# EAGLE design down_converter (EAGLE 6.2)
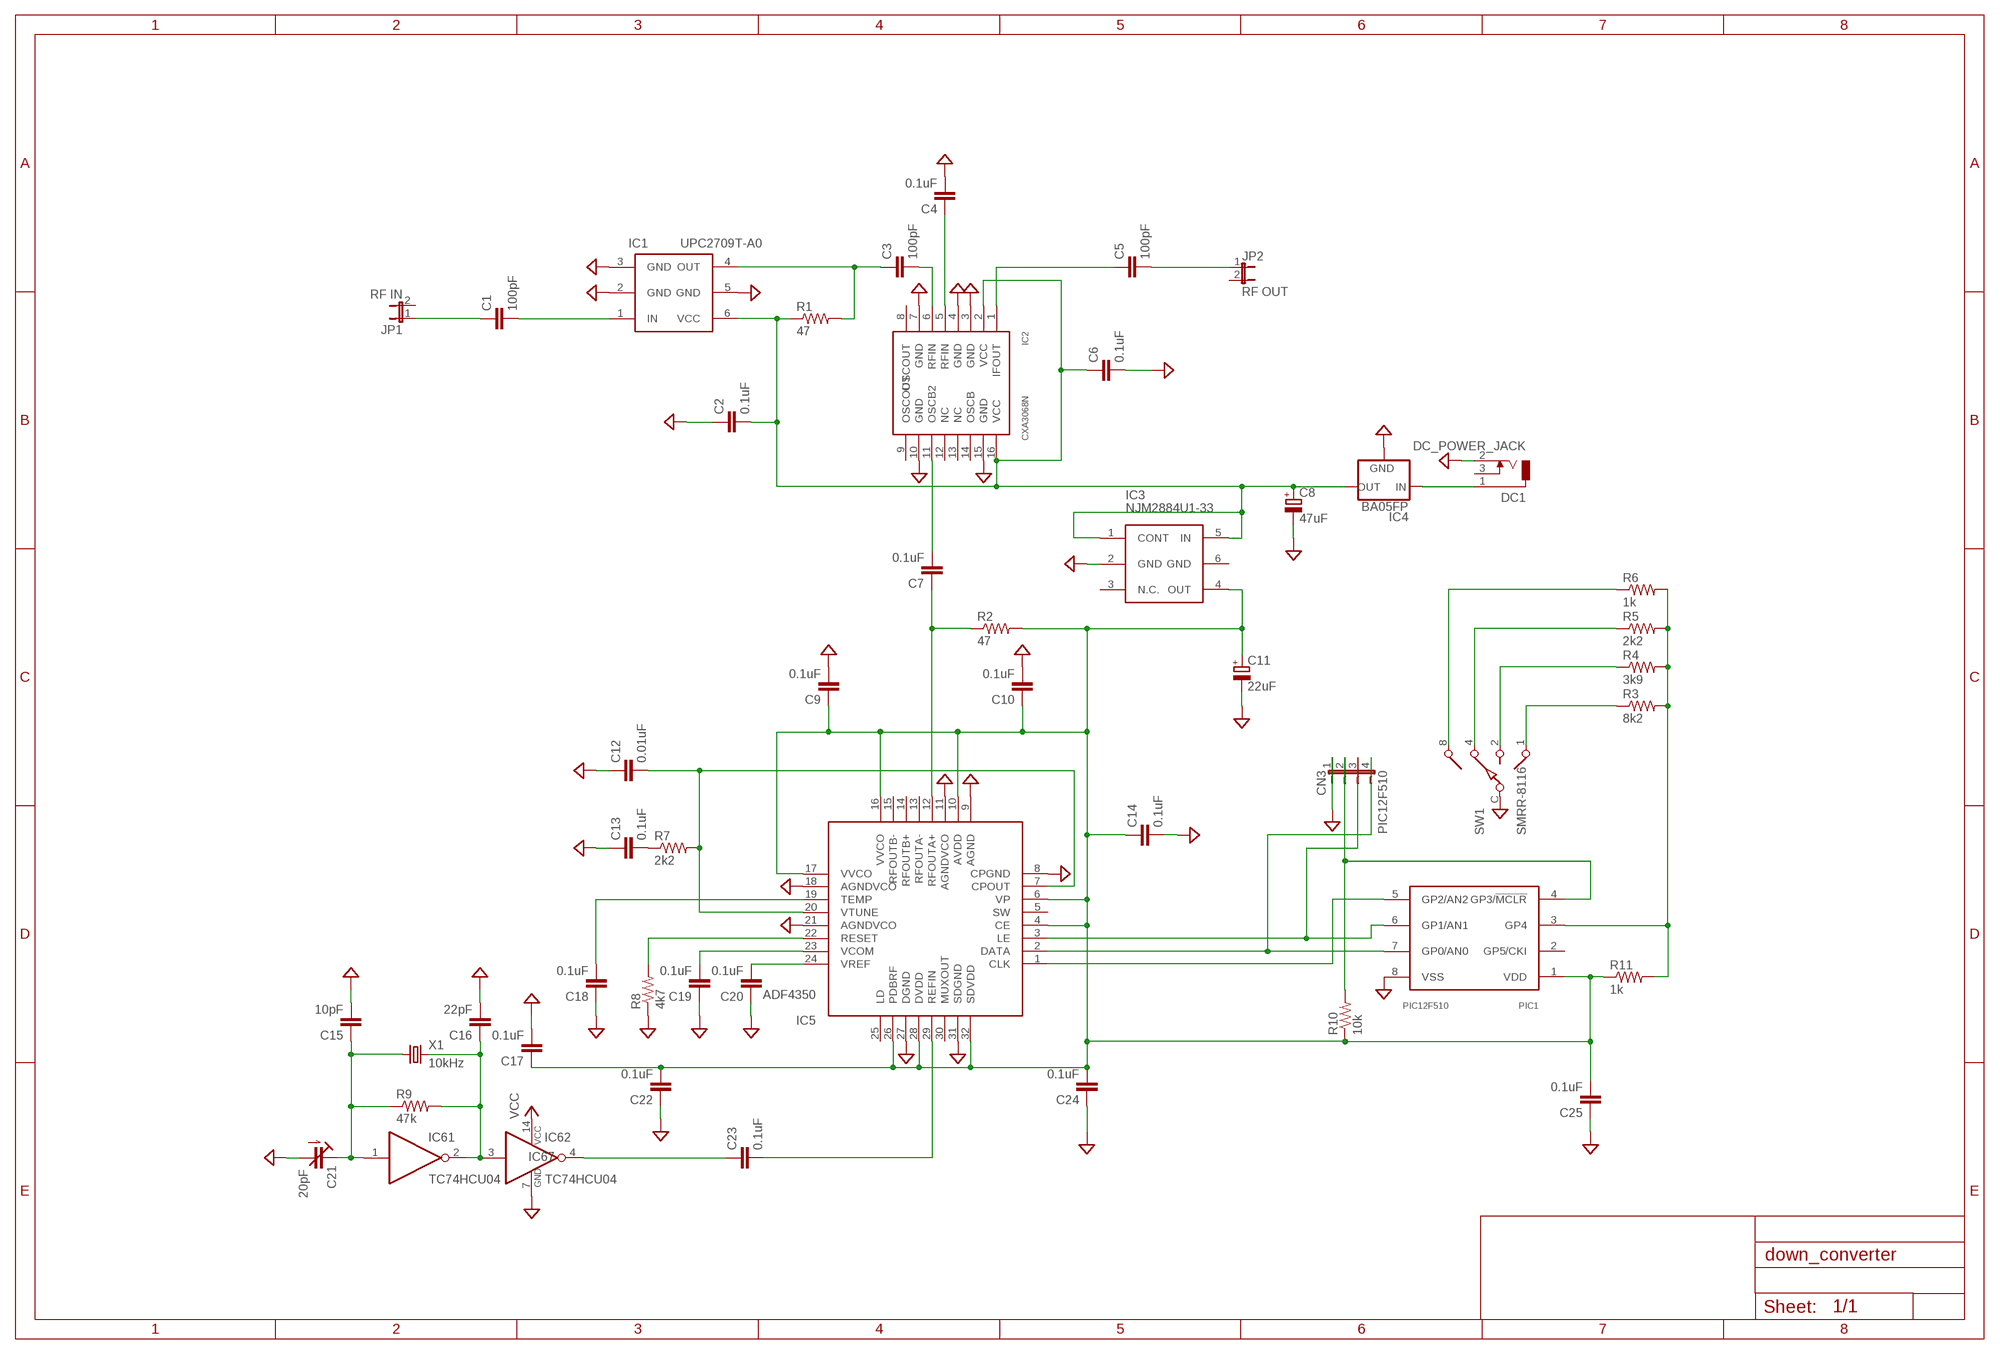
[diagram p0: schematic, sheet 1]

## Parts
C1  100pF  C-EU025-025X050  [C025-025X050]
C2  0.1uF  C-EU050-025X075  [C050-025X075]
C3  100pF  C-EU025-025X050  [C025-025X050]
C4  0.1uF  C-EU050-025X075  [C050-025X075]
C5  100pF  C-EU025-025X050  [C025-025X050]
C6  0.1uF  C-EU050-025X075  [C050-025X075]
C7  0.1uF  C-EU050-025X075  [C050-025X075]
C8  47uF  CPOL-EUE5-10.5  [E5-10,5]
C9  0.1uF  C-EU050-025X075  [C050-025X075]
C10  0.1uF  C-EU050-025X075  [C050-025X075]
C11  22uF  CPOL-EUE3.5-8  [E3,5-8]
C12  0.01uF  C-EU025-025X050  [C025-025X050]
C13  0.1uF  C-EU050-025X075  [C050-025X075]
C14  0.1uF  C-EU050-025X075  [C050-025X075]
C15  10pF  C-EU025-025X050  [C025-025X050]
C16  22pF  C-EU025-025X050  [C025-025X050]
C17  0.1uF  C-EU050-025X075  [C050-025X075]
C18  0.1uF  C-EU050-025X075  [C050-025X075]
C19  0.1uF  C-EU050-025X075  [C050-025X075]
C20  0.1uF  C-EU050-025X075  [C050-025X075]
C21  20pF  C-TRIMMTZ03  [CTRIMTZ03]
C22  0.1uF  C-EU050-025X075  [C050-025X075]
C23  0.1uF  C-EU050-025X075  [C050-025X075]
C24  0.1uF  C-EU050-025X075  [C050-025X075]
C25  0.1uF  C-EU050-025X075  [C050-025X075]
CN3  PIC12F510  JP4E  [JP4]
DC1  DC_POWER_JACK  [DC_POWER_JACK]
IC1  UPC2709T-A0  [SOT23-6]
IC2  CXA3068N  [CXA3068N]
IC3  NJM2884U1-33  [NJM2884U1-33]
IC4  BA05FP  [BA05FP]
IC5  ADF4350  [ADF4350]
IC6  TC74HCU04  [TC74HCU04]
JP1  RF IN  JP1E  [JP1]
JP2  RF OUT  JP1E  [JP1]
PIC1  PIC12F510  [PIC12F1288]
R1  47  R-US_0207/7  [0207/7]
R2  47  R-US_0207/7  [0207/7]
R3  8k2  R-US_0207/7  [0207/7]
R4  3k9  R-US_0207/7  [0207/7]
R5  2k2  R-US_0207/7  [0207/7]
R6  1k  R-US_0207/7  [0207/7]
R7  2k2  R-US_0207/7  [0207/7]
R8  4k7  R-US_0207/7  [0207/7]
R9  47k  R-US_0207/7  [0207/7]
R10  10k  R-US_0207/7  [0207/7]
R11  1k  R-US_0207/7  [0207/7]
SW1  SMRR-8116  SW-C16  [SW-C16]
X1  10kHz  CRYSTALHC49S  [HC49/S]

## Nets
GND: C2.1 C4.2 C6.2 C8.- C9.2 C10.2 C11.- C12.1 C13.1 C14.2 C15.2 C16.2 C17.2 C18.1 C19.1 C20.1 C21.2(A) C22.1 C24.1 C25.1 CN3.1 DC1.2 IC1.2(GND) IC1.3(GND) IC1.5(GND) IC2.3(GND) IC2.4(GND) IC2.7(GND) IC2.10(GND) IC2.15(GND) IC3.2(GND) IC4.2(GND) IC5.8(CPGND) IC5.9(AGND) IC5.11(AGNDVCO) IC5.18(AGNDVCO) IC5.21(AGNDVCO) IC5.27(DGND) IC5.31(SDGND) IC6.7(7:GND) PIC1.8(VSS) R8.1 SW1.C
N$1: C13.2 R7.1
N$2 [gnd]: DC1.1 IC4.1(IN)
N$3: C23.2 IC5.29(REFIN)
N$4: C20.2 IC5.24(VREF)
N$5: C19.2 IC5.23(VCOM)
N$6: IC5.22(RESET) R8.2
N$7: C18.2 IC5.19(TEMP)
N$8: C12.2 IC5.7(CPOUT) IC5.20(VTUNE) R7.2
N$9: C7.1 IC5.12(RFOUTA+) R2.1
N$10: C2.2 C6.1 C8.+ IC1.6(VCC) IC2.2(VCC) IC2.16(VCC) IC3.1(CONT) IC3.5(IN) IC4.3(OUT) R1.1
N$11: IC5.1(CLK) PIC1.5(GP2/AN2)
N$12: PIC1.3(GP4) R3.2 R4.2 R5.2 R6.2 R11.2
N$13: C7.2 IC2.11(OSCB2)
N$15: C3.1 IC1.4(OUT) R1.2
N$16: C1.2 IC1.1(IN)
N$17: C3.2 IC2.6(RFIN)
N$18: C4.1 IC2.5(RFIN)
N$19: C5.1 IC2.1(IFOUT)
N$21: R6.1 SW1.8
N$22: CN3.2 PIC1.4(GP3/!MCLR) R10.2
N$23: R5.1 SW1.4
N$24: R4.1 SW1.2
N$25: R3.1 SW1.1
N$26: CN3.3 IC5.3(LE) PIC1.6(GP1/AN1)
N$27: C5.2 JP2.1
N$28: C1.1 JP1.1
N$29: C9.1 C10.1 C11.+ C14.1 C17.1 C22.2 C24.2 C25.2 IC3.4(OUT) IC5.4(CE) IC5.6(VP) IC5.10(AVDD) IC5.16(VVCO) IC5.17(VVCO) IC5.26(PDBRF) IC5.28(DVDD) IC5.32(SDVDD) PIC1.1(VDD) R2.2 R10.1 R11.1
N$30: C16.1 IC6.2(1:Y) IC6.3(2:A) R9.2 X1.2
N$31: C15.1 C21.1(E) IC6.1(1:A) R9.1 X1.1
N$32: C23.1 IC6.4(2:Y)
N$34: CN3.4 IC5.2(DATA) PIC1.7(GP0/AN0)
VCC: IC6.14(7:VCC)
Unconnected: DC1.3 IC2.8(OSCOUT) IC2.9(OSCOUT) IC2.12(NC) IC2.13(NC) IC2.14(OSCB) IC3.3(N.C.) IC5.5(SW) IC5.13(RFOUTA-) IC5.14(RFOUTB+) IC5.15(RFOUTB-) IC5.25(LD) IC5.30(MUXOUT) IC6.5(3:A) IC6.6(3:Y) IC6.8(4:Y) IC6.9(4:A) IC6.10(5:Y) IC6.11(5:A) IC6.12(6:Y) IC6.13(6:A) JP1.2 JP2.2 PIC1.2(GP5/CKI)

## Power pins joined to a net without a drawn wire
GND: IC3.6(GND)

## Library data of the parts
C1-C3 C5-C7 C12-C16 C18-C20 C22-C25 = rcl:C-EU: CAPACITOR, European symbol
C4 C9 C10 C17 = resistor:C-EU: CAPACITOR, European symbol
C8 C11 = resistor:CPOL-EU: POLARIZED CAPACITOR, European symbol
C21 = rcl:C-TRIMM: Trimm capacitor
CN3 = jumper:JP4E: JUMPER
DC1 = MyLib:DC_POWER_JACK
IC1 = MyLib:UPC2709T: シリコン中出力高周波広帯域増幅器IC 6ピン・ミニモールド
IC2 = MyLib:CXA3068N
IC3 = MyLib:NJM2884U1-33: 18bits Delta-Sigma A/D SOT23 6pin
IC4 = MyLib:BA05FP: Low saturation voltage type 3-pin regulator
IC5 = MyLib:ADF4350: Wideband Synthesizer with Integrated VCO
IC6 = MyLib:TC74HCU04: 東芝CMOSデジタル集積回路 シリコン モノリシック
JP1 JP2 = jumper:JP1E: JUMPER
PIC1 = MyLib:PIC12F510
R1-R11 = rcl:R-US_: RESISTOR, American symbol
SW1 = special:SW-C16: SWITCH 16-step rotary switch
X1 = crystal:CRYSTAL: CRYSTAL; OC_FARNELL: 1667008; OC_NEWARK: unknown

## Net classes
0 default: width 0.203 mm
1 gnd: width 1.27 mm

## Board
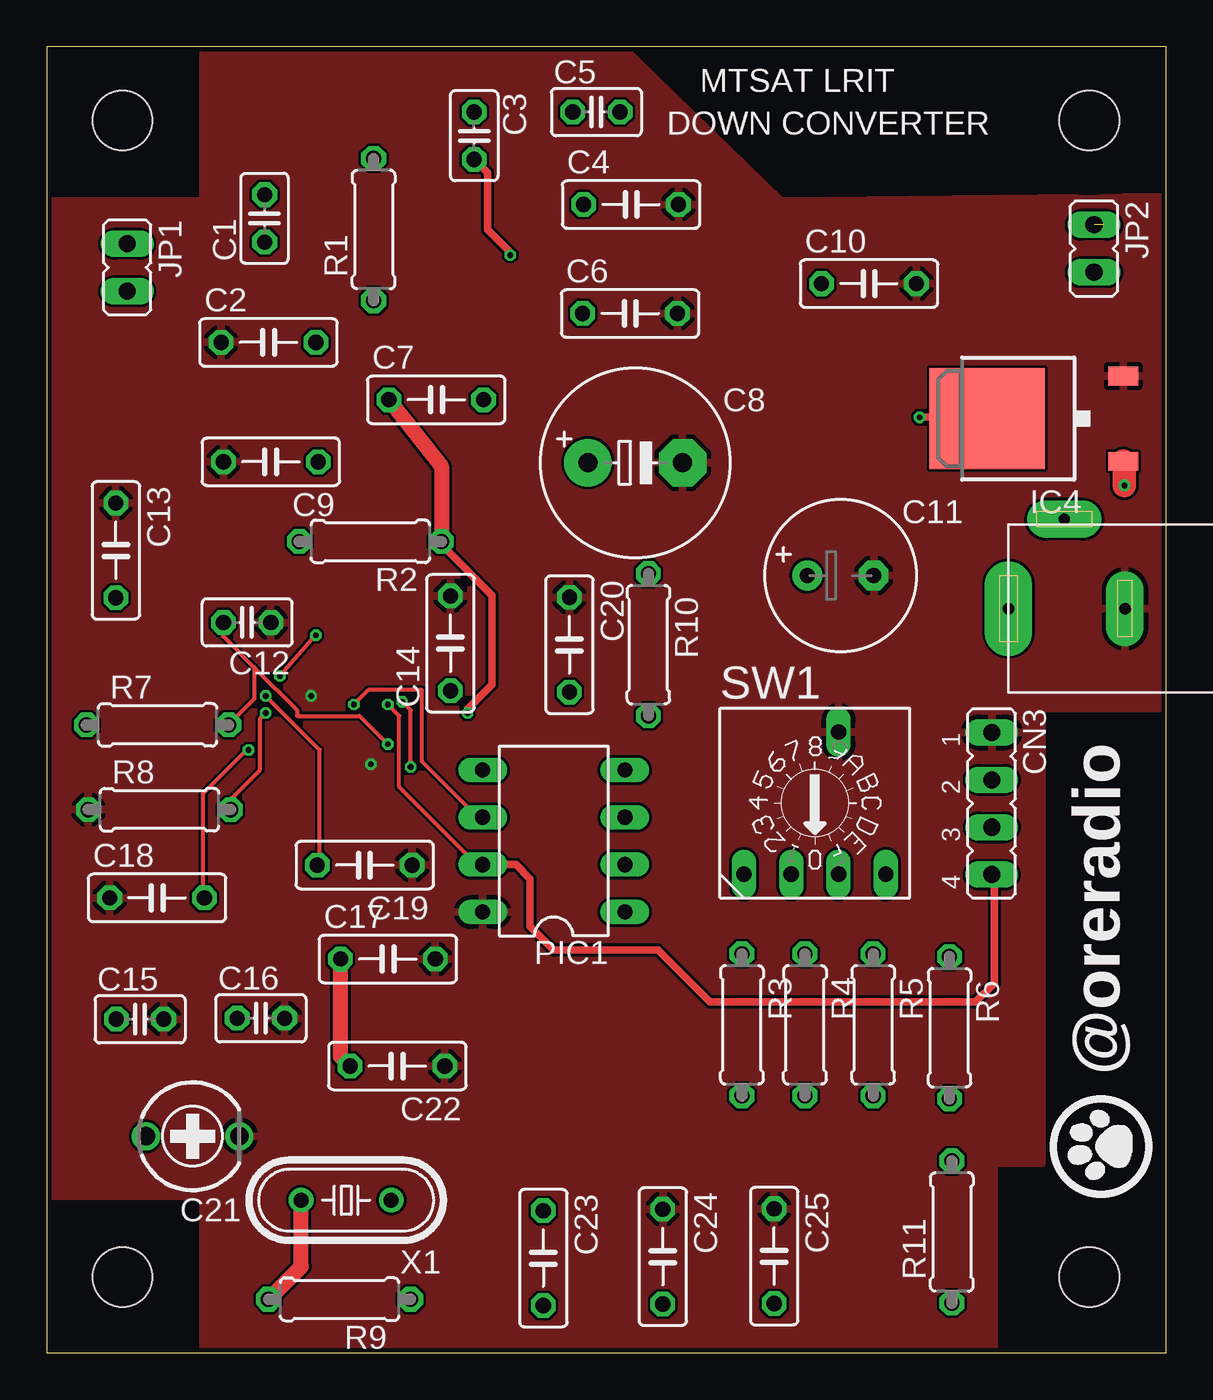
[diagram p1: board, top side]
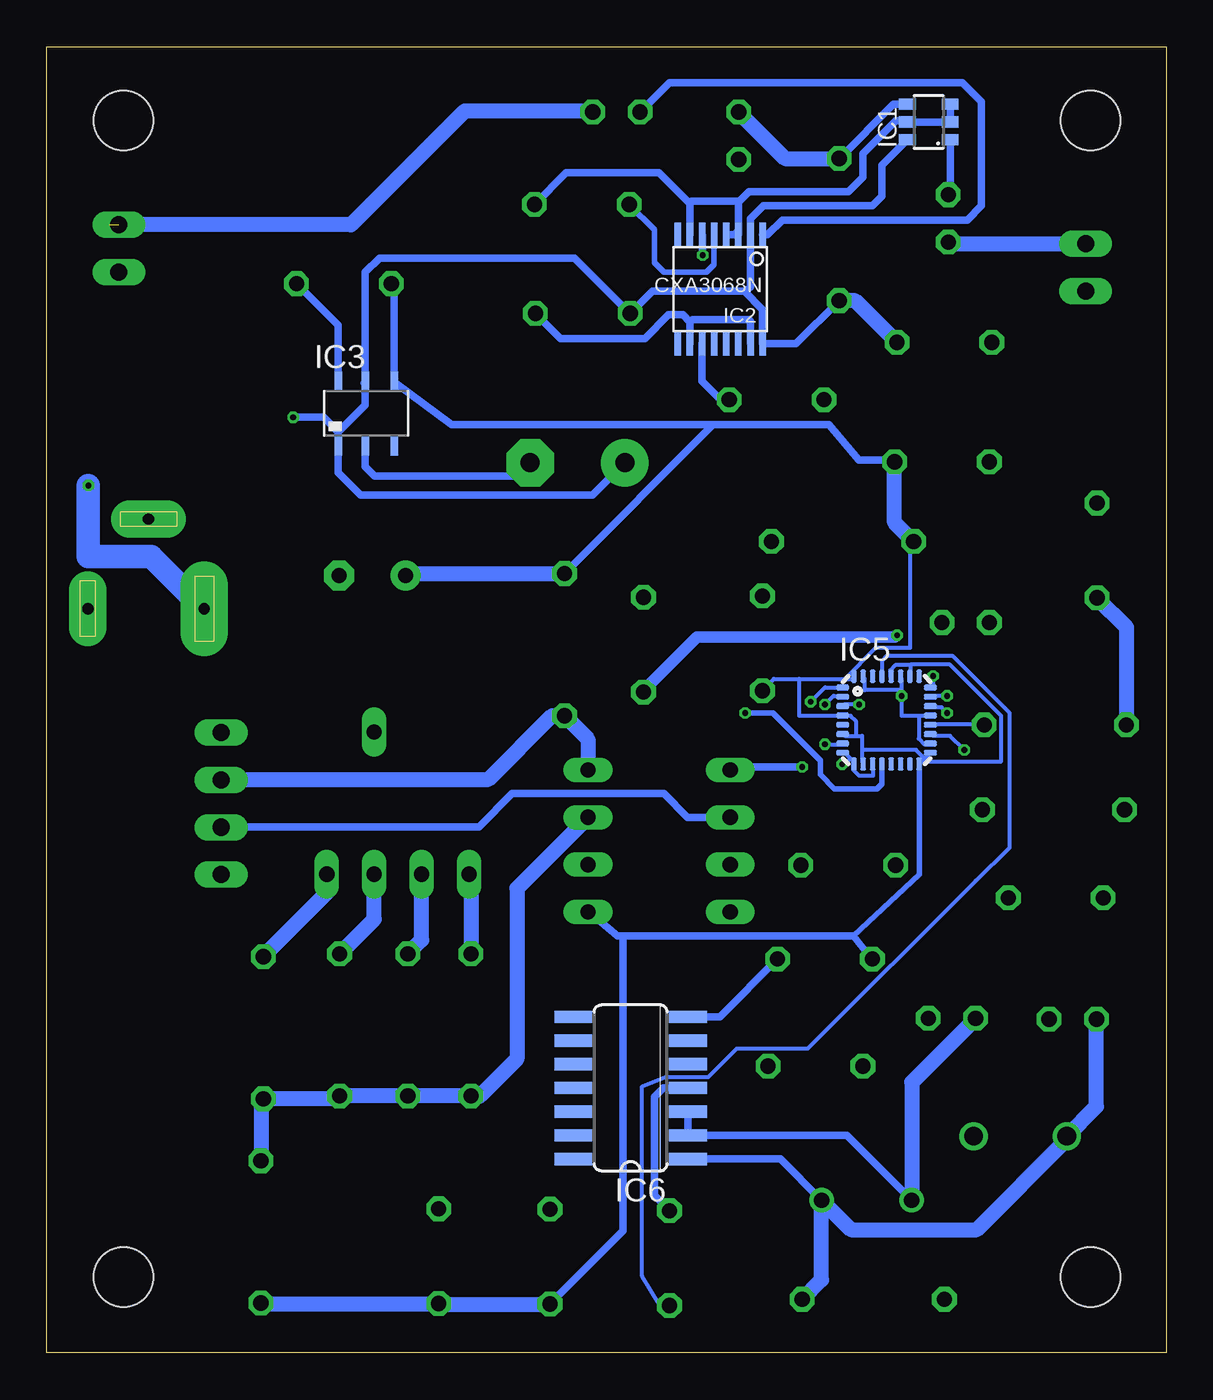
[diagram p2: board, bottom side, seen from below]

Size 60 x 70 mm. Coordinates in mm from the lower left corner, seen from the top.
Outline: 0,0 60,0 60,70 0,70 0,0
Copper layers (1*16): Top 0.035mm / dielectric 1.5mm / Bottom 0.035mm
Design rules: minimum track width 6mil, minimum drill 12mil, track to track 6mil, track to pad 6mil, pad to pad 6mil, via to via 6mil, smd to smd 0mil, copper to edge 10mil, drill to drill 10mil, minimum pad ring 10mil, minimum via ring 6mil, stop-mask expansion 2mil, vias tented up to drill 100mil, thermal gap 10mil
Holes 3.2 mm at 4.06,4.06 55.88,4.06 55.88,66.04 4.06,66.04
tRestrict: area 0.3,62.2 to 7.9,69.9; area 52.1,62.2 to 59.7,69.9; area 52.1,0.3 to 59.7,7.9; area 0.3,0.3 to 7.9,7.9

### Footprints (pad centres in the part's own frame; a part is rotated, then mirrored left to right if it is on the bottom)
C025-025X050 = drill 0.813 octagon: 1 -1.27,0; 2 1.27,0
C050-025X075 = drill 0.813 octagon: 1 -2.54,0; 2 2.54,0
E5-10,5 = drill 1.016 pad 2.54: + -2.54,0 | drill 1.016 pad 2.54 octagon: - 2.54,0
E3,5-8 = drill 0.813 pad 1.6: + -1.778,0 | drill 0.813 pad 1.6 octagon: - 1.778,0
CTRIMTZ03 = drill 1: 1 0,2.5; 2 0,-2.5
JP4 = drill 0.914 long: 1 -3.81,0; 2 -1.27,0; 3 1.27,0; 4 3.81,0
DC_POWER_JACK = drill 0.6 pad 2.54 long: 1 -6.87,0 | drill 0.6 pad 2 long: 2 -0.63,0; 3 -3.88,4.8
SOT23-6 = smd 0.6 x 0.9: 1 -0.95,-1.15; 2 0,-1.15; 3 0.95,-1.15; 4 0.95,1.15; 5 0,1.15; 6 -0.95,1.15
CXA3068N = smd 0.35 x 1.27: 1 -2.275,-2.925; 2 -1.625,-2.925; 3 -0.975,-2.925; 4 -0.325,-2.925; 5 0.325,-2.925; 6 0.975,-2.925; 7 1.625,-2.925; 8 2.275,-2.925; 9 2.275,2.925; 10 1.625,2.925; 11 0.975,2.925; 12 0.325,2.925; 13 -0.325,2.925; 14 -0.975,2.925; 15 -1.625,2.925; 16 -2.275,2.925
NJM2884U1-33 = smd 0.4 x 1.1: 1 -1.45,-1.75; 2 0,-1.75; 3 1.55,-1.75; 4 1.55,1.65; 5 0,1.65; 6 -1.45,1.65
BA05FP = smd 1 x 1.6: 1 -2.28,-6.07; 2 2.28,-6.07 | smd 5.4 x 6.2: 3 0,1.23
ADF4350 = smd 0.7 x 0.3: 1 -2.35,1.75; 2 -2.35,1.25; 3 -2.35,0.75; 4 -2.35,0.25; 5 -2.35,-0.25; 6 -2.35,-0.75; 7 -2.35,-1.25; 8 -2.35,-1.75; 17 2.35,-1.75; 18 2.35,-1.25; 19 2.35,-0.75; 20 2.35,-0.25; 21 2.35,0.25; 22 2.35,0.75; 23 2.35,1.25; 24 2.35,1.75 | smd 0.3 x 0.7: 9 -1.75,-2.35; 10 -1.25,-2.35; 11 -0.75,-2.35; 12 -0.25,-2.35; 13 0.25,-2.35; 14 0.75,-2.35; 15 1.25,-2.35; 16 1.75,-2.35; 25 1.75,2.35; 26 1.25,2.35; 27 0.75,2.35; 28 0.25,2.35; 29 -0.25,2.35; 30 -0.75,2.35; 31 -1.25,2.35; 32 -1.75,2.35
TC74HCU04 = smd 0.66 x 2.032: 1 -3.81,-3.073; 2 -2.54,-3.073; 3 -1.27,-3.073; 4 0,-3.073; 5 1.27,-3.073; 6 2.54,-3.073; 7 3.81,-3.073; 8 3.81,3.073; 9 2.54,3.073; 10 1.27,3.073; 11 0,3.073; 12 -1.27,3.073; 13 -2.54,3.073; 14 -3.81,3.073
JP1 = drill 0.914 long: 1 0,-1.27; 2 0,1.27
PIC12F1288 = drill 0.813 long: 1 -3.81,-3.81; 2 -1.27,-3.81; 3 1.27,-3.81; 4 3.81,-3.81; 5 3.81,3.81; 6 1.27,3.81; 7 -1.27,3.81; 8 -3.81,3.81
0207/7 = drill 0.813 octagon: 1 -3.81,0; 2 3.81,0
SW-C16 = drill 0.813 long: 1 -3.81,-3.81; 2 -1.27,-3.81; 4 1.27,-3.81; 8 3.81,-3.81; C 1.27,3.81
HC49/S = drill 0.813: 1 -2.413,0; 2 2.413,0

### Placement (x,y rotation side)
C1  11.68,60.8 90 top
C2  11.89,54.15 0 top
C3  22.91,65.23 270 top
C4  31.32,61.54 0 top
C5  29.46,66.5 0 top
C6  31.27,55.7 0 top
C7  20.88,51.08 0 top
C8  31.55,47.7 0 top
C9  12.01,47.75 180 top
C10  44.07,57.3 0 top
C11  42.55,41.66 0 top
C12  10.74,39.14 180 top
C13  3.71,43 270 top
C14  21.64,38.02 90 top
C15  5,17.88 0 top
C16  11.48,17.93 0 top
C17  18.29,21.11 0 top
C18  5.92,24.38 0 top
C19  17.04,26.14 180 top
C20  28.02,37.95 270 top
C21  7.82,11.61 90 top
C22  18.8,15.37 180 top
C23  26.62,5.08 270 top
C24  33.02,5.16 270 top
C25  38.99,5.18 270 top
CN3  50.65,29.44 270 top
DC1  58.42,39.88 0 top
IC1  12.73,65.96 90 bottom
IC2  23.9,57 180 bottom
IC3  42.93,50.39 0 bottom
IC4  51.64,50.06 90 top
IC5  14.99,33.91 0 bottom
IC6  28.7,14.2 90 bottom
JP1  4.32,58.17 180 top
JP2  56.13,59.18 180 top
PIC1  27.18,27.43 90 top
R1  17.53,60.2 90 top
R2  17.35,43.48 180 top
R3  37.26,17.58 270 top
R4  40.64,17.58 270 top
R5  44.3,17.58 270 top
R6  48.39,17.42 270 top
R7  5.94,33.66 0 top
R8  6.05,29.11 0 top
R9  15.7,2.87 180 top
R10  32.25,37.96 270 top
R11  48.51,6.48 90 top
SW1  41.17,29.46 0 top
U$40  [LOGO]  59.18,8.38 90 top
X1  16.05,8.18 180 top

### Tracks (layer width: path | path; a pad name or v marks a point on that pad's centre or on a via)
GND  (via drill 0.3)
  Bottom 0.203: IC1.3 | 13.87,65.99 IC1.5 | 11.58,65.99 IC1.2 | 13.26,34.14 13.26,32.92 12.95,32.61 12.65,32.61 IC5.18 | 13.26,34.14 12.65,34.14 IC5.21 | 14.17,35.51 v14.17,35.2 14.17,34.14 13.26,34.14 | 14.17,35.51 14.17,36.12 IC5.27 | 14.17,35.51 16.15,35.51 16.15,36.12 IC5.31 | IC5.11 15.7,31.55 15.7,30.94 16.46,30.94 16.76,31.24 16.76,31.55 IC5.9 16.76,31.7 16.92,31.85 | 16.92,31.85 17.22,32.16 IC5.8 | 16.92,31.85 17.22,31.55 v17.37,31.55 | 23.47,60.05 IC2.4 | 23.01,60.05 IC2.3 | 23.01,61.72 22.93,61.66 | 25.45,61.72 25.53,61.59
  Bottom 0.406: C17.2 23.93,18.01 IC6.7 | C10.2 44.38,55.07 IC3.6 | C8.- 34.8,46.99 42.42,46.99 42.93,47.5 IC3.2 | IC1.3 11.57,66 11.58,65.99 11.61,65.96 IC1.5 13.95,66.04 14.48,66.04 16.26,64.26 16.26,62.99 17.02,62.23 22.35,62.23 22.93,61.66 IC2.3 | C6.2 32.46,54.36 27.94,54.36 26.67,55.63 25.91,55.63 25.53,55.24 | 25.53,55.24 IC2.10 | 25.53,55.24 25.4,55.37 22.35,55.37 22.28,55.3 IC2.15 | 23.01,60.05 23.14,59.92 IC2.4 | C4.2 32.16,63.25 27.18,63.25 25.53,61.59 IC2.7 | 25.45,61.72 23.01,61.72
  pour Top: -0.76,61.72 -0.76,8.38 8.38,8.38 8.38,-1.27 50.8,-1.52 50.8,10.16 53.34,10.16 53.34,34.54 62.23,34.54 62.23,61.98 39.37,61.72 29.72,71.12 8.38,71.12 8.38,61.72
N$1
  Bottom 0.813: C13.2 2.13,38.89 R7.1
N$2  (via drill 0.3)
  Top 1.27: v57.76,46.48 57.76,47.7 IC4.1
  Bottom 1.27: v57.76,46.48 57.76,42.67 54.41,42.67 51.66,39.93 DC1.1
N$3
  Bottom 0.203: 15.24,36.27 IC5.29 15.24,37.09 14.99,37.34 11.43,37.34 8.38,34.29 8.38,27.08 10.21,25.3 19.2,16.31 23.01,16.31 24.54,14.78 26.82,14.78 28.09,14.28 28.09,4.12 27.18,2.59 C23.2
N$4  (via drill 0.3)
  Top 0.203: v14.43,38.46 v12.5,36.27
  Bottom 0.203: v12.5,36.27 12.5,35.66 IC5.24
  Bottom 0.61: v14.43,38.46 14.53,38.35 25.15,38.35 28.02,35.48 C20.2
N$5  (via drill 0.3)
  Top 0.203: v11.73,35.2 14.63,32.31 14.63,26.21 C19.2
  Bottom 0.203: v11.73,35.2 12.5,35.2 IC5.23
N$6  (via drill 0.3)
  Top 0.203: v11.73,34.29 11.43,33.98 11.43,31.24 9.91,29.72 9.91,29.11 R8.2
  Bottom 0.203: v11.73,34.29 12.04,34.59 12.5,34.59 IC5.22
N$7  (via drill 0.3)
  Top 0.203: C18.2 8.38,24.46 8.38,29.97 10.72,32.31
  Top 0.406: 10.72,32.31 v10.82,32.31
  Bottom 0.203: v10.82,32.31 11.58,33.07 12.5,33.07 IC5.19
N$8  (via drill 0.3)
  Top 0.203: v18.29,32.61 16.76,34.14 13.41,34.14 13.41,34.44 11.12,36.73 | 11.12,36.73 9.45,38.41 9.45,39.01 C12.2 | 11.12,36.73 11.12,35.05 9.75,33.68 R7.2
  Bottom 0.203: IC5.20 12.5,33.68 9.75,33.68 R7.2 | v18.29,32.61 17.37,32.61 IC5.7
N$9  (via drill 0.3)
  Top 0.203: 21.18,43.28 21.18,43.43 R2.1
  Top 0.406: 21.18,43.28 23.88,40.59 23.88,35.81 22.55,34.49 v22.55,34.29
  Top 0.813: C7.1 21.16,47.5 R2.1
  Bottom 0.203: 15.24,31.55 IC5.12
  Bottom 0.305: 15.24,31.55 15.24,30.48 15.49,30.23 17.78,30.23 18.54,30.99 18.54,31.75 21.08,34.29 v22.55,34.29
N$10  (via drill 0.3)
  Top 0.203: 50.29,50.14 IC4.3
  Top 0.406: v46.79,50.14 50.29,50.14
  Bottom 0.203: 44.35,48.77 IC3.1 | 42.98,51.97 IC3.5 | 22.4,57 22.55,57 22.61,56.9
  Bottom 0.406: C8.+ 30.73,45.97 43.18,45.97 44.38,47.17 IC3.1 44.38,49.35 | 42.98,51.97 42.93,51.92 42.93,50.8 44.38,49.35 | 44.38,49.35 45.17,50.14 v46.79,50.14 | IC3.5 42.93,57.91 42.16,58.67 31.7,58.67 C6.1 27.53,56.9 22.61,56.9 21.63,55.92 IC2.16 19.84,54.07 R1.1 | 22.4,57 22.28,57.12 IC2.2 22.28,60.78 21.59,61.47 15.75,61.47 15.24,61.98 15.24,63.65 IC1.6
  Bottom 0.813: C2.2 16.66,56.39 R1.1
N$11  (via drill 0.3)
  Top 0.203: v19.05,34.9 19.51,34.44 v19.51,31.39
  Bottom 0.203: v19.05,34.9 18.29,35.66 17.37,35.66 IC5.1
  Bottom 0.406: PIC1.5 23.22,31.39 v19.51,31.39
N$12
  Bottom 0.813: R11.2 48.51,13.49 R6.2 44.45,13.61 R5.2 R4.2 R3.2 36.78,13.77 34.8,15.75 34.8,24.89 PIC1.3
N$13
  Bottom 0.406: IC2.11 24.89,54.06 24.89,52.07 23.9,51.08 C7.2
N$15
  Bottom 0.406: R1.2 14.62,66.91 IC1.4
  Bottom 0.813: C3.1 20.42,64.01 R1.2
N$16
  Bottom 0.406: C1.2 11.57,62.17 IC1.1
N$17  (via drill 0.3)
  Top 0.406: C3.2 23.62,63.25 23.62,60.2 24.84,58.98 v24.84,58.83
  Bottom 0.203: 24.84,59.89 IC2.6
  Bottom 0.406: v24.84,58.83 24.84,59.89
N$18
  Bottom 0.305: C4.1 27.43,60.2 27.43,58.42 26.92,57.91 24.64,57.91 24.23,58.32 IC2.5
N$19
  Bottom 0.406: C5.1 26.62,68.07 10.92,68.07 9.91,67.06 9.91,61.47 10.67,60.71 20.57,60.71 21.36,59.92 IC2.1
N$21
  Bottom 0.813: R6.1 44.98,24.64 SW1.8
N$22
  Bottom 0.813: PIC1.4 30.99,32.88 R10.2 32.91,34.15 36.32,30.73 50.62,30.73 CN3.2
N$23
  Bottom 0.813: R5.1 42.44,23.24 SW1.4
N$24
  Bottom 0.813: R4.1 39.9,22.12 SW1.2
N$25
  Bottom 0.813: SW1.1 37.26,25.65 R3.1
N$26  (via drill 0.3)
  Top 0.203: v16.46,34.75 17.22,35.51 20.12,35.51 20.12,31.7 23.01,28.8 23.32,28.8 PIC1.6
  Bottom 0.203: v16.46,34.75 17.22,34.75 IC5.3
  Bottom 0.406: CN3.3 50.62,28.19 36.83,28.19 35.05,29.97 26.92,29.97 25.65,28.7 PIC1.6
N$27  (1 unrouted)
  Bottom 0.813: C5.2 30.79,66.55 37.59,66.55 43.69,60.45 56.64,60.45
N$28
  Bottom 0.813: C1.1 11.59,59.44 JP1.1
N$29
  Top 0.813: C22.2 15.75,15.88 C17.1
  Bottom 0.203: 41.3,51.97 IC3.4 | 14.63,47.85 C9.1 | 19.66,36.12 21.03,36.12 21.64,35.51 C14.1 | 19.66,36.12 17.22,36.12 | 17.22,36.12 16.76,36.12 IC5.32 | 16.31,32.31 16.31,33.07 16.61,33.07 | 16.31,32.31 16.31,31.7 IC5.10 | 16.61,33.07 17.22,33.07 IC5.6 | 16.61,33.07 16.61,33.83 16.92,34.14 17.22,34.14 IC5.4 17.37,34.14 19.66,34.14 19.66,36.12 | 13.72,36.88 13.72,36.27 IC5.26 | 13.72,36.88 14.48,36.88 14.78,36.58 14.78,36.27 IC5.28 | 12.95,31.85 IC5.17 | 12.95,31.85 13.11,31.7 | 13.72,36.88 11.58,36.88 8.84,34.14 8.84,31.7 13.11,31.7 | 13.11,31.7 IC5.16 | 16.31,32.31 13.41,32.31 12.95,31.85 | 15.85,21.18 C17.1 | 17.22,36.12 15.54,37.8 13.72,37.8 13.72,43.13 R2.2
  Bottom 0.305: 16.76,22.35 13.24,25.63 IC5.16
  Bottom 0.406: 41.3,51.97 38.3,49.73 24.28,49.73 | 24.28,49.73 18.09,49.73 16.46,47.85 14.63,47.85 | 29.11,22.35 16.76,22.35 15.85,21.18 | 29.11,22.35 29.41,22.35 30.94,23.62 PIC1.1 | 29.11,22.35 29.11,6.55 32.92,2.74 C24.2 | C10.1 41.38,57.15 IC3.4 | R10.1 24.28,49.73
  Bottom 0.813: C24.2 33.07,2.59 38.86,2.59 C25.2 48.49,2.64 R11.1 | C11.+ 40.66,41.77 R10.1 | R2.2 14.55,44.5 C9.1
N$30
  Top 0.813: R9.2 13.64,4.62 X1.2
  Bottom 0.406: X1.2 17.12,11.66 IC6.2 IC6.3
  Bottom 0.813: C16.1 13.64,14.5 X1.2
N$31
  Bottom 0.406: X1.1 20.68,10.39 IC6.1
  Bottom 0.813: R9.1 18.47,3.91 X1.1 16.89,6.6 10.16,6.6 5.32,11.44 C21.1 3.73,13.2 C15.1
N$32
  Bottom 0.406: C23.1 27.43,8.43 27.43,13.72 26.95,14.2 IC6.4
N$34  (via drill 0.3)
  Top 0.203: v18.29,34.75 18.9,34.14 18.9,30.33 23.01,26.21 23.32,26.21 PIC1.7
  Top 0.406: CN3.4 50.8,25.48 50.8,19.81 49.78,18.8 35.56,18.8 32.77,21.59 27.18,21.59 25.91,22.86 25.91,25.4 25.15,26.16 PIC1.7
  Bottom 0.203: v18.29,34.75 17.83,35.2 17.37,35.2 IC5.2

### Text on the board
tNames: Order Number: 53979 | MTSAT LRIT | DOWN CONVERTER